# Altium schematic sheet PowerSupplySystem.SchDoc
size B
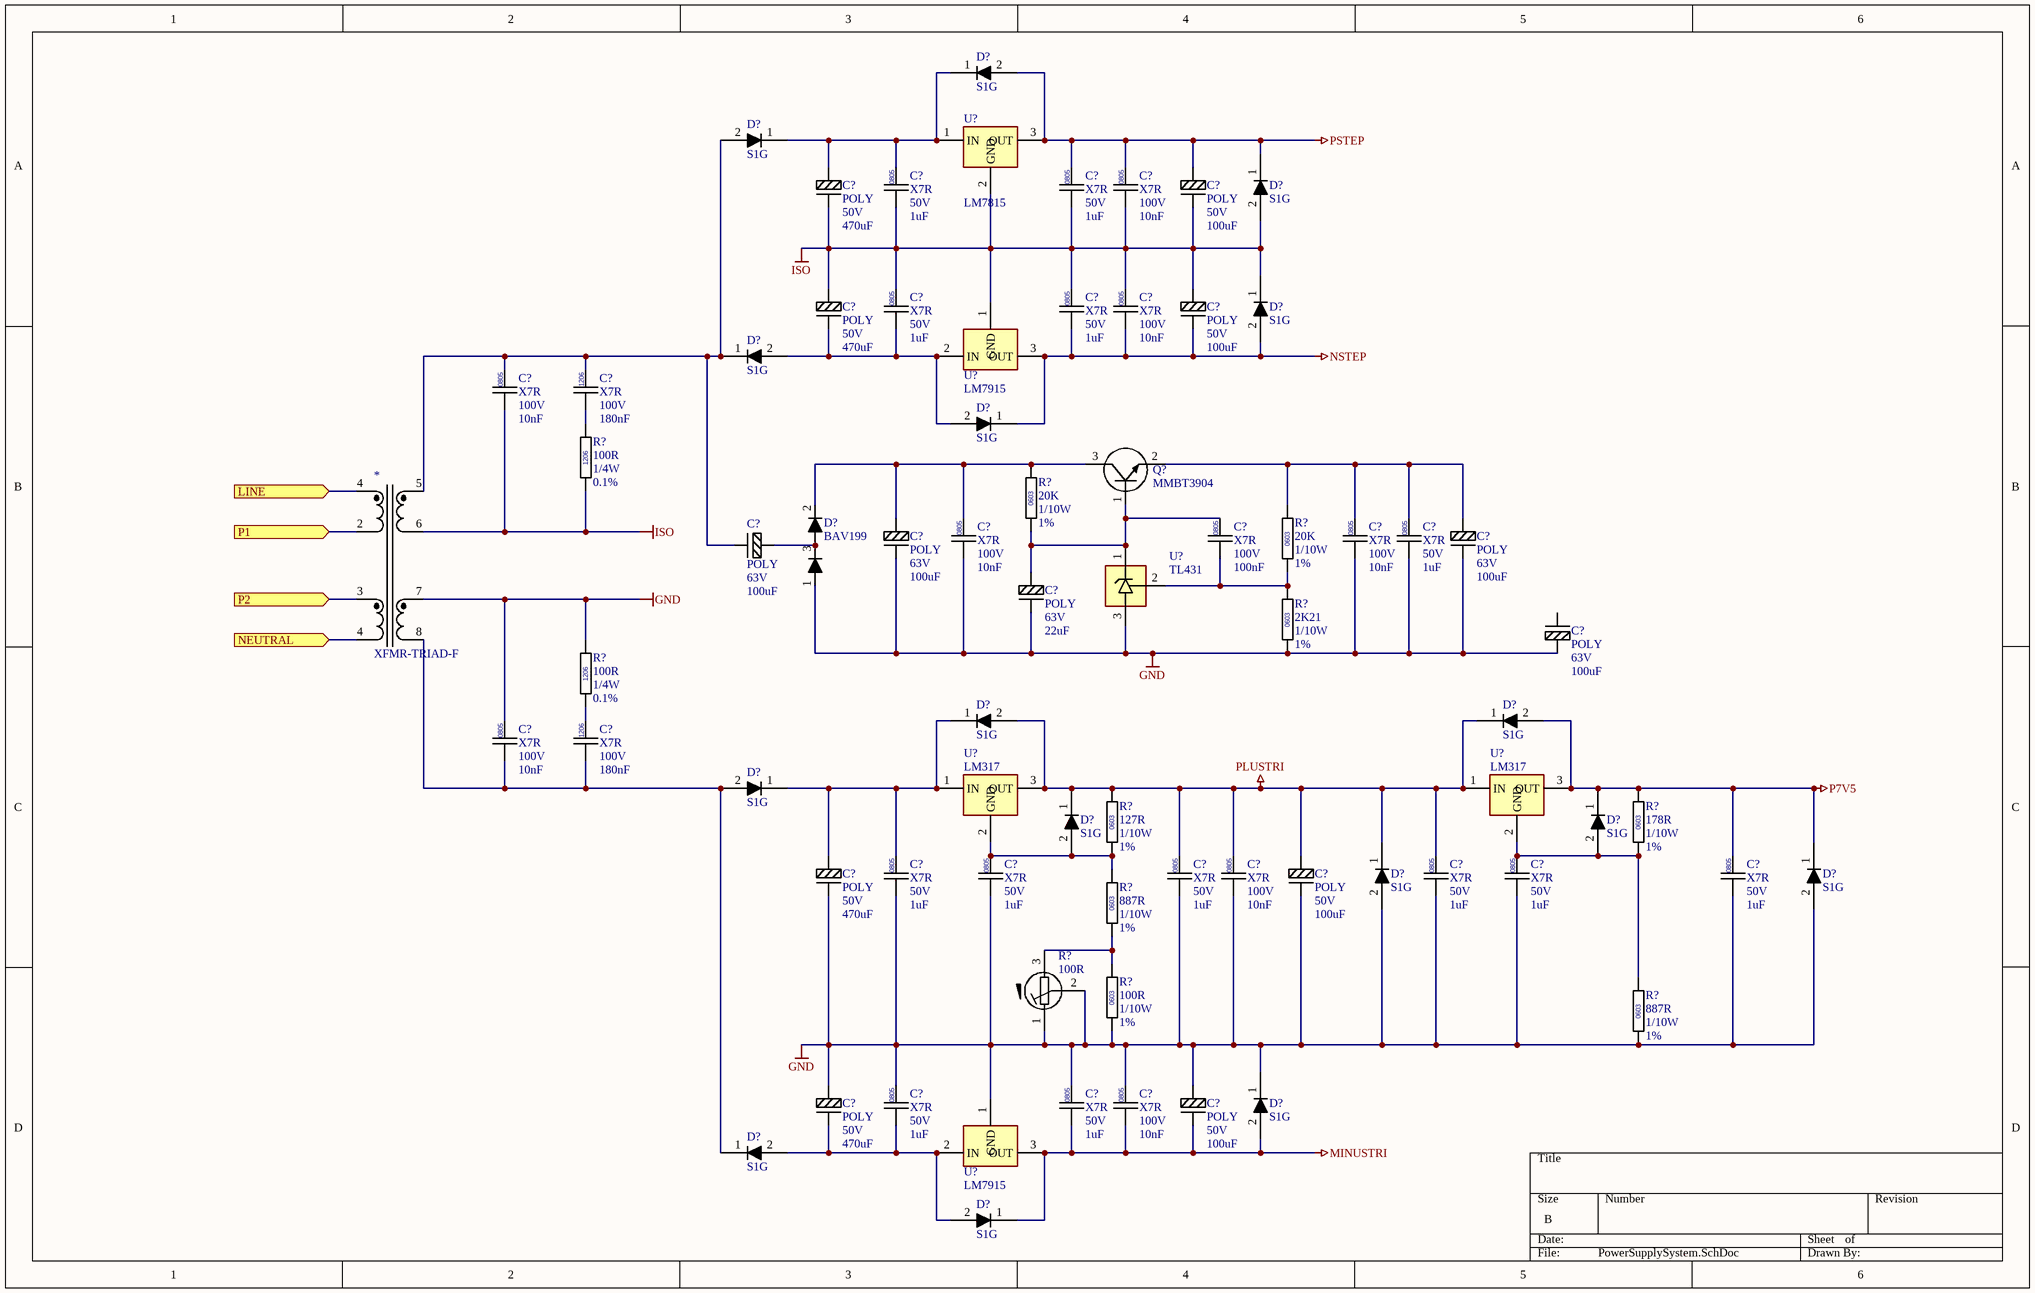
[diagram p0: PowerSupplySystem.SchDoc]

## Parts
(Parts that share a designator on the sheet are numbered #1, #2 ... from top to bottom, then left to right.)
*  XFMR-TRIAD-F
C?#1  Dielectric: POLY  Voltage: 50V  Capacitance: 470uF  [CAPC0603]  (hidden comment: CAPP)
C?#2  Dielectric: X7R  Voltage: 50V  Capacitance: 1uF  [CAPC0805]  (hidden comment: CAP0805)
C?#3  Dielectric: X7R  Voltage: 50V  Capacitance: 1uF  [CAPC0805]  (hidden comment: CAP0805)
C?#4  Dielectric: X7R  Voltage: 100V  Capacitance: 10nF  [CAPC0805]  (hidden comment: CAP0805)
C?#5  Dielectric: POLY  Voltage: 50V  Capacitance: 100uF  [CAPC0603]  (hidden comment: CAPP)
C?#6  Dielectric: POLY  Voltage: 50V  Capacitance: 470uF  [CAPC0603]  (hidden comment: CAPP)
C?#7  Dielectric: X7R  Voltage: 50V  Capacitance: 1uF  [CAPC0805]  (hidden comment: CAP0805)
C?#8  Dielectric: X7R  Voltage: 50V  Capacitance: 1uF  [CAPC0805]  (hidden comment: CAP0805)
C?#9  Dielectric: X7R  Voltage: 100V  Capacitance: 10nF  [CAPC0805]  (hidden comment: CAP0805)
C?#10  Dielectric: POLY  Voltage: 50V  Capacitance: 100uF  [CAPC0603]  (hidden comment: CAPP)
C?#11  Dielectric: X7R  Voltage: 100V  Capacitance: 10nF  [CAPC0805]  (hidden comment: CAP0805)
C?#12  Dielectric: X7R  Voltage: 100V  Capacitance: 180nF  [CAPC0805]  (hidden comment: CAP0805)
C?#13  Dielectric: POLY  Voltage: 63V  Capacitance: 100uF  [CAPC0603]  (hidden comment: CAPP)
C?#14  Dielectric: X7R  Voltage: 100V  Capacitance: 10nF  [CAPC0805]  (hidden comment: CAP0805)
C?#15  Dielectric: X7R  Voltage: 100V  Capacitance: 100nF  [CAPC0805]  (hidden comment: CAP0805)
C?#16  Dielectric: X7R  Voltage: 100V  Capacitance: 10nF  [CAPC0805]  (hidden comment: CAP0805)
C?#17  Dielectric: X7R  Voltage: 50V  Capacitance: 1uF  [CAPC0805]  (hidden comment: CAP0805)
C?#18  Dielectric: POLY  Voltage: 63V  Capacitance: 100uF  [CAPC0603]  (hidden comment: CAPP)
C?#19  Dielectric: POLY  Voltage: 63V  Capacitance: 100uF  [CAPC0603]  (hidden comment: CAPP)
C?#20  Dielectric: POLY  Voltage: 63V  Capacitance: 22uF  [CAPC0603]  (hidden comment: CAPP)
C?#21  Dielectric: POLY  Voltage: 63V  Capacitance: 100uF  [CAPC0603]  (hidden comment: CAPP)
C?#22  Dielectric: X7R  Voltage: 100V  Capacitance: 10nF  [CAPC0805]  (hidden comment: CAP0805)
C?#23  Dielectric: X7R  Voltage: 100V  Capacitance: 180nF  [CAPC0805]  (hidden comment: CAP0805)
C?#24  Dielectric: POLY  Voltage: 50V  Capacitance: 470uF  [CAPC0603]  (hidden comment: CAPP)
C?#25  Dielectric: X7R  Voltage: 50V  Capacitance: 1uF  [CAPC0805]  (hidden comment: CAP0805)
C?#26  Dielectric: X7R  Voltage: 50V  Capacitance: 1uF  [CAPC0805]  (hidden comment: CAP0805)
C?#27  Dielectric: X7R  Voltage: 50V  Capacitance: 1uF  [CAPC0805]  (hidden comment: CAP0805)
C?#28  Dielectric: X7R  Voltage: 100V  Capacitance: 10nF  [CAPC0805]  (hidden comment: CAP0805)
C?#29  Dielectric: POLY  Voltage: 50V  Capacitance: 100uF  [CAPC0603]  (hidden comment: CAPP)
C?#30  Dielectric: X7R  Voltage: 50V  Capacitance: 1uF  [CAPC0805]  (hidden comment: CAP0805)
C?#31  Dielectric: X7R  Voltage: 50V  Capacitance: 1uF  [CAPC0805]  (hidden comment: CAP0805)
C?#32  Dielectric: X7R  Voltage: 50V  Capacitance: 1uF  [CAPC0805]  (hidden comment: CAP0805)
C?#33  Dielectric: POLY  Voltage: 50V  Capacitance: 470uF  [CAPC0603]  (hidden comment: CAPP)
C?#34  Dielectric: X7R  Voltage: 50V  Capacitance: 1uF  [CAPC0805]  (hidden comment: CAP0805)
C?#35  Dielectric: X7R  Voltage: 50V  Capacitance: 1uF  [CAPC0805]  (hidden comment: CAP0805)
C?#36  Dielectric: X7R  Voltage: 100V  Capacitance: 10nF  [CAPC0805]  (hidden comment: CAP0805)
C?#37  Dielectric: POLY  Voltage: 50V  Capacitance: 100uF  [CAPC0603]  (hidden comment: CAPP)
D?#1  S1G
D?#2  S1G
D?#3  S1G
D?#4  S1G
D?#5  S1G
D?#6  S1G
D?#7  BAV199  [SOD323]
D?#8  S1G
D?#9  S1G
D?#10  S1G
D?#11  S1G
D?#12  S1G
D?#13  S1G
D?#14  S1G
D?#15  S1G
D?#16  S1G
D?#17  S1G
Q?  MMBT3904  [SOT23]
R?#1  value 100R  Power: 1/4W  Tolerance: 0.1%  [RESC1206]  (hidden comment: RESC1206)
R?#2  value 20K  Power: 1/10W  Tolerance: 1%  [RESC0603]  (hidden comment: RESC0603)
R?#3  value 20K  Power: 1/10W  Tolerance: 1%  [RESC0603]  (hidden comment: RESC0603)
R?#4  value 2K21  Power: 1/10W  Tolerance: 1%  [RESC0603]  (hidden comment: RESC0603)
R?#5  value 100R  Power: 1/4W  Tolerance: 0.1%  [RESC1206]  (hidden comment: RESC1206)
R?#6  value 127R  Power: 1/10W  Tolerance: 1%  [RESC0603]  (hidden comment: RESC0603)
R?#7  value 178R  Power: 1/10W  Tolerance: 1%  [RESC0603]  (hidden comment: RESC0603)
R?#8  value 887R  Power: 1/10W  Tolerance: 1%  [RESC0603]  (hidden comment: RESC0603)
R?#9  value 100R  Power: 1/10W  Tolerance: 1%  [RESC0603]  (hidden comment: RESC0603)
R?#10  value 887R  Power: 1/10W  Tolerance: 1%  [RESC0603]  (hidden comment: RESC0603)
R?#11  value 100R  [TRIMMER-BOURNS-TC33]  (hidden comment: TRIMMER-BOURNS-TC33X-2-101E)
U?#1  LM7815  [SOT23]
U?#2  LM7915  [SOT23]
U?#3  TL431  [SOT23]
U?#4  LM317  [SOT23]
U?#5  LM317  [SOT23]
U?#6  LM7915  [SOT23]

## Ports
LINE (in), NEUTRAL (in), P1 (in), P2 (in)

## Nets
GND: *.7 C?#13.2 C?#14.2 C?#16.2 C?#17.2 C?#18.2 C?#20.2 C?#21.1 C?#22.1 C?#24.2 C?#25.2 C?#26.2 C?#27.2 C?#28.2 C?#29.2 C?#30.2 C?#31.2 C?#32.2 C?#33.1 C?#34.1 C?#35.1 C?#36.1 C?#37.1 D?#7.1(K) D?#13.2(A) D?#14.2(A) D?#15.1(K) R?#4.2 R?#5.1 R?#9.2 R?#10.2 R?#11.1 R?#11.2 U?#3.3 U?#6.1(GND)
ISO: *.6 C?#1.2 C?#2.2 C?#3.2 C?#4.2 C?#5.2 C?#6.1 C?#7.1 C?#8.1 C?#9.1 C?#10.1 C?#11.2 D?#3.2(A) D?#4.1(K) R?#1.2 U?#1.2(GND) U?#2.1(GND)
MINUSTRI: C?#35.2 C?#36.2 C?#37.2 D?#15.2(A) D?#17.1(K) U?#6.3(OUT)
NSTEP: C?#8.2 C?#9.2 C?#10.2 D?#4.2(A) D?#6.1(K) U?#2.3(OUT)
P7V5: C?#32.1 D?#9.2(A) D?#12.1(K) D?#14.1(K) R?#7.1 U?#5.3(OUT)
PLUSTRI: C?#27.1 C?#28.1 C?#29.1 C?#30.1 D?#8.2(A) D?#9.1(K) D?#11.1(K) D?#13.1(K) R?#6.1 U?#4.3(OUT) U?#5.1(IN)
PSTEP: C?#3.1 C?#4.1 C?#5.1 D?#1.2(A) D?#3.1(K) U?#1.3(OUT)
LINE: *.4 ; port LINE
NEUTRAL: *.4 ; port NEUTRAL
P1: *.2 ; port P1
P2: *.3 ; port P2
Net*_5: *.5 C?#11.1 C?#12.1 C?#19.2 D?#2.2(A) D?#5.1(K)
Net*_8: *.8 C?#22.2 C?#23.2 D?#10.2(A) D?#16.1(K)
NetC?#1_1: C?#1.1 C?#2.1 D?#1.1(K) D?#2.1(K) U?#1.1(IN)
NetC?#6_2: C?#6.2 C?#7.2 D?#5.2(A) D?#6.2(A) U?#2.2(IN)
NetC?#12_2: C?#12.2 R?#1.1
NetC?#13_1: C?#13.1 C?#14.1 D?#7.2(A) Q?.3(C) R?#2.1
NetC?#15_1: C?#15.1 C?#20.1 Q?.1(B) R?#2.2 U?#3.1
NetC?#15_2: C?#15.2 R?#3.2 R?#4.1 U?#3.2
NetC?#16_1: C?#16.1 C?#17.1 C?#18.1 Q?.2(E) R?#3.1
NetC?#19_1: C?#19.1 D?#7.3(A)
NetC?#23_1: C?#23.1 R?#5.2
NetC?#24_1: C?#24.1 C?#25.1 D?#8.1(K) D?#10.1(K) U?#4.1(IN)
NetC?#26_1: C?#26.1 D?#11.2(A) R?#6.2 R?#8.1 U?#4.2(GND)
NetC?#31_1: C?#31.1 D?#12.2(A) R?#7.2 R?#10.1 U?#5.2(GND)
NetC?#33_2: C?#33.2 C?#34.2 D?#16.2(A) D?#17.2(A) U?#6.2(IN)
NetR?#8_2: R?#8.2 R?#9.1 R?#11.3

Not connected (* = marked no-connect by the designer): C?#21 2

## Notes on the sheet
- (in symbol CAPC-0805-1uF-50V) 0805
- (in symbol CAPC-0805-10nF-100V) 0805
- (in symbol CAPC-0805-100nF-100V) 0805
- (in symbol GENERIC-CAPC-1206_1) 1206
- (in symbol RESC-0603-2K21-1%-1/10W) 0603
- (in symbol RESC-0603-20K-1%-1/10W) 0603
- (in symbol RESC-0603-100R-1%-1/10W) 0603
- (in symbol RESC-0603-127R-1%-1/10W) 0603
- (in symbol RESC-0603-178R-1%-1/10W) 0603
- (in symbol RESC-0603-887R-1%-1/10W) 0603
- (in symbol RESC-1206-100R-0.1%-1/4W) 1206

## Library data of the parts
C?#1 C?#6 C?#24 C?#33 = CAPP-0603-470uF-50V-POLY: CAPACITOR,POLYMER,470uF,50V,100X102; Manufacturer 1: PANASONIC; Manufacturer Part Number 1: EEHZC1H101P; Package / Case: CAPP100D102H; Location: *; LCSC: C161937
C?#2 C?#3 C?#7 C?#8 C?#17 C?#25-C?#27 C?#30-C?#32 C?#34 C?#35 = CAPC-0805-1uF-50V: CAPACITOR,CERAMIC,1uF,50V,X7R,0805; Package / Case: 0805 (2012 metric); Location: *
C?#4 C?#9 C?#11 C?#14 C?#16 C?#22 C?#28 C?#36 = CAPC-0805-10nF-100V: CAPACITOR,CERAMIC,10nF,100V,X7R,0805; Package / Case: 0805 (2012 metric); Location: *
C?#5 C?#10 C?#29 C?#37 = CAPP-0603-100uF-50V-POLY: CAPACITOR,POLYMER,100uF,50V,100X102; Manufacturer 1: PANASONIC; Manufacturer Part Number 1: EEHZC1H101P; Package / Case: CAPP100D102H; Location: *; LCSC: C161937
C?#12 C?#23 = GENERIC-CAPC-1206_1: CAPACITOR,CERAMIC,180nF,100V,X7R,1206; Package / Case: 0805 (2012 metric); Location: *
C?#13 C?#18 C?#19 C?#21 = CAPP-0603-100uF-63V-POLY: CAPACITOR,POLYMER,100uF,63V,100X102; Manufacturer 1: PANASONIC; Manufacturer Part Number 1: EEHZC1H101P; Package / Case: CAPP100D102H; Location: *; LCSC: C161937
C?#15 = CAPC-0805-100nF-100V: CAPACITOR,CERAMIC,100nF,100V,X7R,0805; Package / Case: 0805 (2012 metric); Location: *
C?#20 = CAPP-0603-22uF-63V-POLY: CAPACITOR,POLYMER,22uF,63V,100X102; Manufacturer 1: PANASONIC; Manufacturer Part Number 1: EEHZC1H101P; Package / Case: CAPP100D102H; Location: *; LCSC: C161937
D?#1-D?#6 D?#8-D?#17 = DIODE-SMC-S1G: Manufacturer 1: SMC DIODE SOLUTIONS; Manufacturer Part Number 1: S1G
D?#7 = DIODE-DIODES-BAV199: DIODE,75V,215mA,SOT23,LOW LEAKAGE; Supplier 1: Arrow Electronics; Supplier Part Number 1: BAV116WS-7
Q? = XSTR-NPN-MMBT3904: XSTR,NPN,SOT23,MMBT3904
R?#1 R?#5 = RESC-1206-100R-0.1%-1/4W: RESISTOR,100R,1206,0.1%,125mW,0805; Location: *; Parameter 4: *
R?#2 R?#3 = RESC-0603-20K-1%-1/10W: RESISTOR,20K,1%,100mW,0603 (1608); Location: *; LCSC: C105588; Supplier 1: Digikey; Supplier Part Number 1: 311-100HRCT-ND
R?#4 = RESC-0603-2K21-1%-1/10W: RESISTOR,2K21,1%,100mW,0603 (1608); Location: *; LCSC: C105588; Supplier 1: Digikey; Supplier Part Number 1: 311-100HRCT-ND
R?#6 = RESC-0603-127R-1%-1/10W: RESISTOR,127R,1%,100mW,0603 (1608); Location: *; LCSC: C105588; Supplier 1: Digikey; Supplier Part Number 1: 311-100HRCT-ND
R?#7 = RESC-0603-178R-1%-1/10W: RESISTOR,178R,1%,100mW,0603 (1608); Location: *; LCSC: C105588; Supplier 1: Digikey; Supplier Part Number 1: 311-100HRCT-ND
R?#8 R?#10 = RESC-0603-887R-1%-1/10W: RESISTOR,887R,1%,100mW,0603 (1608); Location: *; LCSC: C105588
R?#9 = RESC-0603-100R-1%-1/10W: RESISTOR,100R,1%,100mW,0603 (1608); Location: *; LCSC: C105588; Supplier 1: Digikey; Supplier Part Number 1: 311-100HRCT-ND
R?#11 = TRIMMER-BOURNS-TC33X-2-101E: RES,TRIM,SMD,100R; Manufacturer 1: BOURNS; Manufacturer Part Number 1: TC33X-2-101E; MOUSER: 652-TC33X-2-101E
U?#1 = IC-TI-LM7815: IC,VOLTAGE REG,LIN,POSITIVE,15V,7815,TO220; LCSC: C460608
U?#2 U?#6 = IC-TI-LM7915: IC,VOLTAGE REG,LIN,NEGATIVE,7915,TO220; LCSC: C460608
U?#3 = IC-TI-TL431: IC,VOLTAGE REFERENCE,3.0V; Supplier 1: Mouser; Supplier Part Number 1: 926-LM4040AIM330NOPB; LCSC: C460608
U?#4 U?#5 = IC-TI-LM317: IC,VOLTAGE REG,LIN,POSITIVE,ADJ,LM317,TO220